# Altium schematic sheet Motor_Driver.SchDoc
size A4
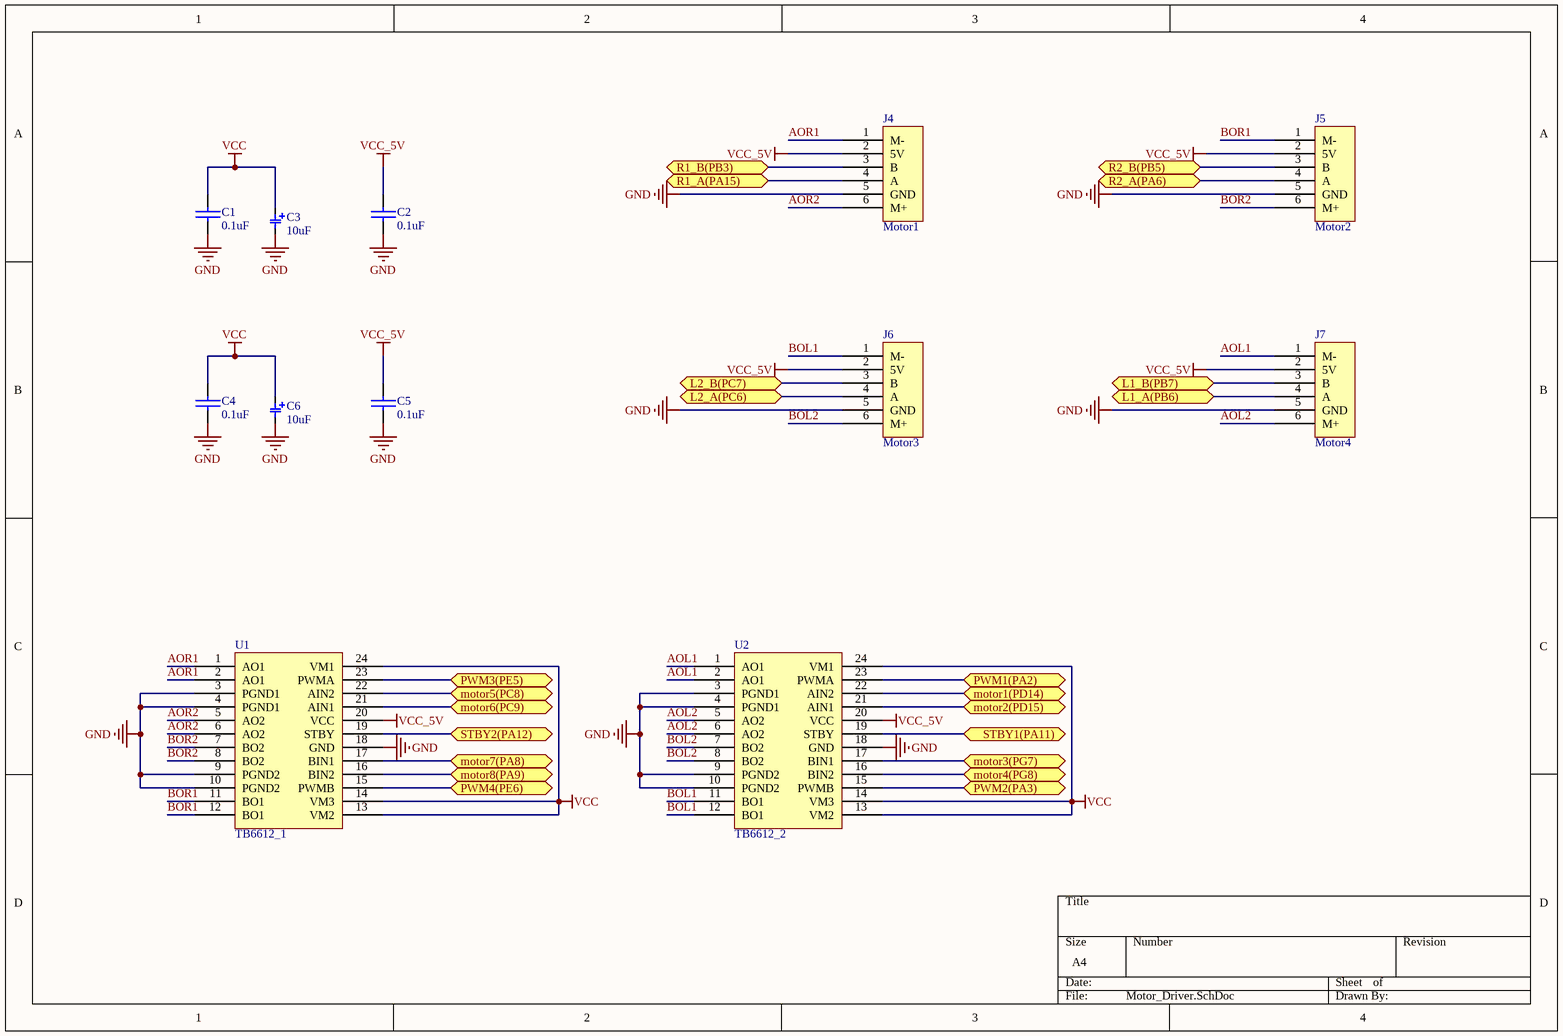
[diagram p0: Motor_Driver.SchDoc]

## Parts
C1  0.1uF  [0603_C]
C2  0.1uF  [0603_C]
C3  10uF  [CASE-B_3528]
C4  0.1uF  [0603_C]
C5  0.1uF  [0603_C]
C6  10uF  [CASE-B_3528]
J4  Motor1  [XH2.54-WI-6P]
J5  Motor2  [XH2.54-WI-6P]
J6  Motor3  [XH2.54-WI-6P]
J7  Motor4  [XH2.54-WI-6P]
U1  TB6612_1  [SSOP-24_208mil]
U2  TB6612_2  [SSOP-24_208mil]

## Ports
L1_A(PB6) (bidir), L1_B(PB7) (bidir), L2_A(PC6) (bidir), L2_B(PC7) (bidir), motor1(PD14) (bidir), motor2(PD15) (bidir), motor3(PG7) (bidir), motor4(PG8) (bidir), motor5(PC8) (bidir), motor6(PC9) (bidir), motor7(PA8) (bidir), motor8(PA9) (bidir), PWM1(PA2) (bidir), PWM2(PA3) (bidir), PWM3(PE5) (bidir), PWM4(PE6) (bidir), R1_A(PA15) (bidir), R1_B(PB3) (bidir), R2_A(PA6) (bidir), R2_B(PB5) (bidir), STBY1(PA11) (bidir), STBY2(PA12) (bidir)

## Nets
GND: C1.2 C2.2 C3.2 C4.2 C5.2 C6.2 J4.5(GND) J5.5(GND) J6.5(GND) J7.5(GND) U1.3(PGND1) U1.4(PGND1) U1.9(PGND2) U1.10(PGND2) U1.18(GND) U2.3(PGND1) U2.4(PGND1) U2.9(PGND2) U2.10(PGND2) U2.18(GND)
VCC: C1.1 C3.1 C4.1 C6.1 U1.13(VM2) U1.14(VM3) U1.24(VM1) U2.13(VM2) U2.14(VM3) U2.24(VM1)
VCC_5V: C2.1 C5.1 J4.2(5V) J5.2(5V) J6.2(5V) J7.2(5V) U1.20(VCC) U2.20(VCC)
AOL1: J7.1(M-) U2.1(AO1) U2.2(AO1)
AOL2: J7.6(M+) U2.5(AO2) U2.6(AO2)
AOR1: J4.1(M-) U1.1(AO1) U1.2(AO1)
AOR2: J4.6(M+) U1.5(AO2) U1.6(AO2)
BOL1: J6.1(M-) U2.11(BO1) U2.12(BO1)
BOL2: J6.6(M+) U2.7(BO2) U2.8(BO2)
BOR1: J5.1(M-) U1.11(BO1) U1.12(BO1)
BOR2: J5.6(M+) U1.7(BO2) U1.8(BO2)
L1_A(PB6): J7.4(A) ; port L1_A(PB6)
L1_B(PB7): J7.3(B) ; port L1_B(PB7)
L2_A(PC6): J6.4(A) ; port L2_A(PC6)
L2_B(PC7): J6.3(B) ; port L2_B(PC7)
motor1(PD14): U2.22(AIN2) ; port motor1(PD14)
motor2(PD15): U2.21(AIN1) ; port motor2(PD15)
motor3(PG7): U2.17(BIN1) ; port motor3(PG7)
motor4(PG8): U2.16(BIN2) ; port motor4(PG8)
motor5(PC8): U1.22(AIN2) ; port motor5(PC8)
motor6(PC9): U1.21(AIN1) ; port motor6(PC9)
motor7(PA8): U1.17(BIN1) ; port motor7(PA8)
motor8(PA9): U1.16(BIN2) ; port motor8(PA9)
PWM1(PA2): U2.23(PWMA) ; port PWM1(PA2)
PWM2(PA3): U2.15(PWMB) ; port PWM2(PA3)
PWM3(PE5): U1.23(PWMA) ; port PWM3(PE5)
PWM4(PE6): U1.15(PWMB) ; port PWM4(PE6)
R1_A(PA15): J4.4(A) ; port R1_A(PA15)
R1_B(PB3): J4.3(B) ; port R1_B(PB3)
R2_A(PA6): J5.4(A) ; port R2_A(PA6)
R2_B(PB5): J5.3(B) ; port R2_B(PB5)
STBY1(PA11): U2.19(STBY) ; port STBY1(PA11)
STBY2(PA12): U1.19(STBY) ; port STBY2(PA12)

## Library data of the parts
C1 C2 C4 C5 = 普通电容: Capacitor
C3 C6 = ECAP
J4-J7 = Component_4
U1 U2 = Component_3